# Altium schematic sheet LDO.SchDoc
size A4
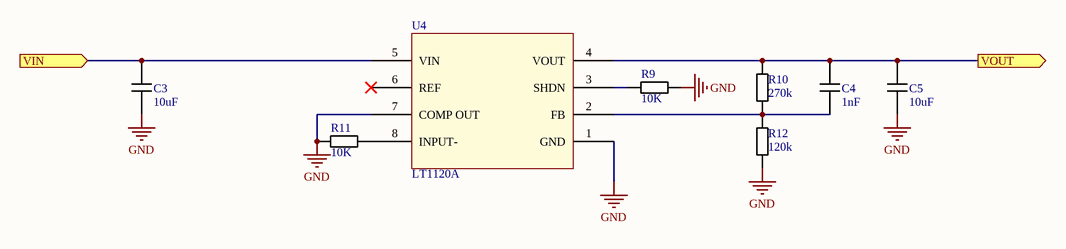
[diagram p0: LDO.SchDoc]

## Parts
C3  value 10uF  [0805 Cap]  (hidden comment: 0805 Cap)
C4  value 1nF  [0805 Cap]  (hidden comment: 0805 Cap)
C5  value 10uF  [0805 Cap]  (hidden comment: 0805 Cap)
R9  value 10K  [0805 Resistor]  (hidden comment: 0805 Resistor)
R10  value 270k  [0805 Resistor]  (hidden comment: 0805 Resistor)
R11  value 10K  [0805 Resistor]  (hidden comment: 0805 Resistor)
R12  value 120k  [0805 Resistor]  (hidden comment: 0805 Resistor)
U4  LT1120A  [SOIC8 - LT1120A]

## Ports
VIN (in), VOUT (out)

## Nets
GND: C3.1 C5.1 R9.2 R11.1 R12.1 U4.1(GND) U4.7(COMP_OUT)
VIN: C3.2 U4.5(VIN) ; port VIN
VOUT: C4.2 C5.2 R10.2 U4.4(VOUT) ; port VOUT
NetC4_1: C4.1 R10.1 R12.2 U4.2(FB)
NetR9_1: R9.1 U4.3(SHDN)
NetR11_2: R11.2 U4.8(INPUT-)

Not connected (* = marked no-connect by the designer): U4 6(REF)*

## Library data of the parts
C3-C5 = 0805 MLCC - NP0, 5%: Supplier: Digikey
  C3 C5: Supplier P/N: JMK212AB7106KG-T
  C4: Supplier P/N: UMK212B7105KG-T
R9-R12 = 0805 Thick Film Resistor 1%: Supplier: Digikey
  R9 R11: Supplier P/N: RMCF0805FT10K0CT-ND
  R10: Supplier P/N: RC0805FR-07270KL
  R12: Supplier P/N: RC0805FR-07120KL
U4 = LT1120A: Low Dropout Regulator; Supplier: Digikey; Supplier P/N: LT1120ACS8#PBF-ND